# Altium schematic sheet 1_micro.SchDoc: Teseu - MCU
size A4; Author: Gustavo Mariz; CompanyName: Trincabotz; DrawnBy: Gustavo Mariz; Engineer: Gustavo Mariz; Organization: Trincabotz; DocumentNumber: 1; Revision: 0.1; SheetNumber: 2; SheetTotal: 6
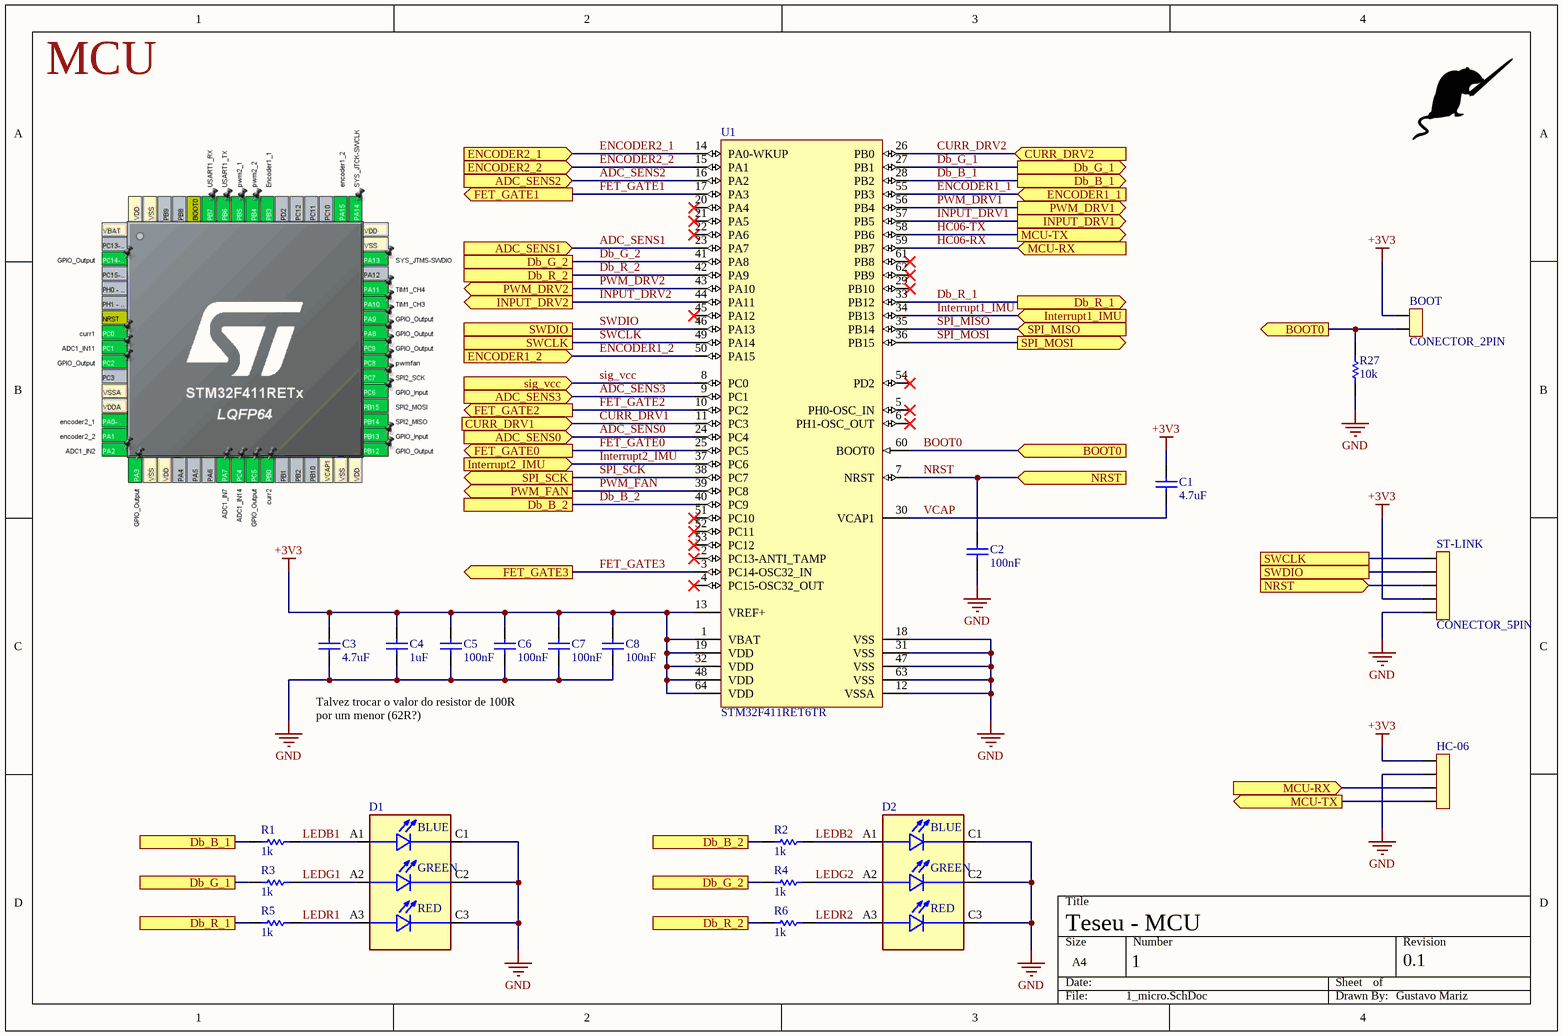
[diagram p0: 1_micro.SchDoc]

## Parts
BOOT  CONECTOR_2PIN  [CON2]
C1  Valor: 4.7uF  [0603]  (hidden comment: CAP)
C2  Valor: 100nF  [0603]  (hidden comment: CAP)
C3  Valor: 4.7uF  [0603]  (hidden comment: CAP)
C4  Valor: 1uF  [0603]  (hidden comment: CAP)
C5  Valor: 100nF  [0603]  (hidden comment: CAP)
C6  Valor: 100nF  [0603]  (hidden comment: CAP)
C7  Valor: 100nF  [0603]  (hidden comment: CAP)
C8  Valor: 100nF  [0603]  (hidden comment: CAP)
D1  KRTBLSLPS1.32-VUVX-EQ+BTBV-D8+TWTZ-L1-B  [LED_KRTBLSLPS1.32-VUVX-EQ+BTBV-D8+TWTZ-L1-B]  (value not drawn)
D2  KRTBLSLPS1.32-VUVX-EQ+BTBV-D8+TWTZ-L1-B  [LED_KRTBLSLPS1.32-VUVX-EQ+BTBV-D8+TWTZ-L1-B]  (value not drawn)
HC-06  (no value)  [CON4]
R1  value 1k  [RES 0603]  (hidden comment: RESISTOR)
R2  value 1k  [RES 0603]  (hidden comment: RESISTOR)
R3  value 1k  [RES 0603]  (hidden comment: RESISTOR)
R4  value 1k  [RES 0603]  (hidden comment: RESISTOR)
R5  value 1k  [RES 0603]  (hidden comment: RESISTOR)
R6  value 1k  [RES 0603]  (hidden comment: RESISTOR)
R27  value 10k  [RES 0805]  (hidden comment: RESISTOR)
ST-LINK  CONECTOR_5PIN  [CON5]
U1  STM32F411RET6TR  [STM-LQFP64_L]

## Ports
ADC_SENS0 (in, see 4_sensores[2B]), ADC_SENS1 (in, see 4_sensores[4B]), ADC_SENS2 (in, see 4_sensores[2C]), ADC_SENS3 (in, see 4_sensores[4C]), BOOT0 (in, see 1_micro[4B]), BOOT0 (out, see 1_micro[3B]), CURR_DRV1 (in, see 2_drivers_e_Motores[3B]), CURR_DRV2 (in, see 2_drivers_e_Motores[3C]), Db_B_1 (out, see 1_micro[1D]), Db_B_1 (see 1_micro[3A]), Db_B_2 (see 1_micro[2B]), Db_B_2 (see 1_micro[2D]), Db_G_1 (out, see 1_micro[1D]), Db_G_1 (see 1_micro[3A]), Db_G_2 (see 1_micro[2B]), Db_G_2 (see 1_micro[2D]), Db_R_1 (out, see 1_micro[1D]), Db_R_1 (see 1_micro[3B]), Db_R_2 (see 1_micro[2B]), Db_R_2 (see 1_micro[2D]), ENCODER1_1 (in, see 2_drivers_e_Motores[4B]), ENCODER1_2 (in, see 2_drivers_e_Motores[4B]), ENCODER2_1 (in, see 2_drivers_e_Motores[4C]), ENCODER2_2 (in, see 2_drivers_e_Motores[4C]), FET_GATE0 (out, see 4_sensores[1B]), FET_GATE1 (out, see 4_sensores[2B]), FET_GATE2 (out, see 4_sensores[1D]), FET_GATE3 (out, see 4_sensores[2D]), INPUT_DRV1 (out, see 2_drivers_e_Motores[2A]), INPUT_DRV2 (out, see 2_drivers_e_Motores[2C]), Interrupt1_IMU (in, see 3_imu[2B]), Interrupt2_IMU (in, see 3_imu[2B]), MCU-RX (in, see 1_micro[3A]), MCU-RX (in, see 1_micro[4D]), MCU-TX (out, see 1_micro[3A]), MCU-TX (out, see 1_micro[4D]), NRST (in, see 1_micro[3B]), NRST (in, see 1_micro[4C]), PWM_DRV1 (out, see 2_drivers_e_Motores[2A]), PWM_DRV2 (out, see 2_drivers_e_Motores[2C]), PWM_FAN (out), sig_vcc (in, see 5_power[2C]), SPI_MISO (in, see 3_imu[3B]), SPI_MOSI (out, see 3_imu[3B]), SPI_SCK (out, see 3_imu[2C]), SWCLK (see 1_micro[2B]), SWCLK (see 1_micro[4C]), SWDIO (see 1_micro[2B]), SWDIO (see 1_micro[4C])

## Nets
+3V3: BOOT.2 C1.2 C3.2 C4.2 C5.2 C6.2 C7.2 C8.2 HC-06.4 ST-LINK.2 U1.1(VBAT) U1.13(VREF+) U1.19(VDD) U1.32(VDD) U1.48(VDD) U1.64(VDD)
GND: C2.1 C3.1 C4.1 C5.1 C6.1 C7.1 C8.1 D1.C1(CATHODE_BLUE) D1.C2(CATHODE_TRUE_GREEN) D1.C3(CATHODE_RED) D2.C1(CATHODE_BLUE) D2.C2(CATHODE_TRUE_GREEN) D2.C3(CATHODE_RED) HC-06.3 R27.1 ST-LINK.1 U1.12(VSSA) U1.18(VSS) U1.31(VSS) U1.47(VSS) U1.63(VSS)
ADC_SENS0: U1.24(PC4) ; port ADC_SENS0
ADC_SENS1: U1.23(PA7) ; port ADC_SENS1
ADC_SENS2: U1.16(PA2) ; port ADC_SENS2
ADC_SENS3: U1.9(PC1) ; port ADC_SENS3
BOOT0: BOOT.1 R27.2 U1.60(BOOT0) ; port BOOT0
CURR_DRV1: U1.11(PC3) ; port CURR_DRV1
CURR_DRV2: U1.26(PB0) ; port CURR_DRV2
Db_B_1: R1.1 U1.28(PB2) ; port Db_B_1
Db_B_2: R2.1 U1.40(PC9) ; port Db_B_2
Db_G_1: R3.1 U1.27(PB1) ; port Db_G_1
Db_G_2: R4.1 U1.41(PA8) ; port Db_G_2
Db_R_1: R5.1 U1.33(PB12) ; port Db_R_1
Db_R_2: R6.1 U1.42(PA9) ; port Db_R_2
ENCODER1_1: U1.55(PB3) ; port ENCODER1_1
ENCODER1_2: U1.50(PA15) ; port ENCODER1_2
ENCODER2_1: U1.14(PA0-WKUP) ; port ENCODER2_1
ENCODER2_2: U1.15(PA1) ; port ENCODER2_2
FET_GATE0: U1.25(PC5) ; port FET_GATE0
FET_GATE1: U1.17(PA3) ; port FET_GATE1
FET_GATE2: U1.10(PC2) ; port FET_GATE2
FET_GATE3: U1.3(PC14-OSC32_IN) ; port FET_GATE3
HC06-RX: HC-06.2 U1.59(PB7) ; port MCU-RX
HC06-TX: HC-06.1 U1.58(PB6) ; port MCU-TX
INPUT_DRV1: U1.57(PB5) ; port INPUT_DRV1
INPUT_DRV2: U1.44(PA11) ; port INPUT_DRV2
Interrupt1_IMU: U1.34(PB13) ; port Interrupt1_IMU
Interrupt2_IMU: U1.37(PC6) ; port Interrupt2_IMU
LEDB1: D1.A1(ANODE_BLUE) R1.2
LEDB2: D2.A1(ANODE_BLUE) R2.2
LEDG1: D1.A2(ANODE_TRUE_GREEN) R3.2
LEDG2: D2.A2(ANODE_TRUE_GREEN) R4.2
LEDR1: D1.A3(ANODE_RED) R5.2
LEDR2: D2.A3(ANODE_RED) R6.2
NRST: C2.2 ST-LINK.3 U1.7(NRST) ; port NRST
PWM_DRV1: U1.56(PB4) ; port PWM_DRV1
PWM_DRV2: U1.43(PA10) ; port PWM_DRV2
PWM_FAN: U1.39(PC8) ; port PWM_FAN
sig_vcc: U1.8(PC0) ; port sig_vcc
SPI_MISO: U1.35(PB14) ; port SPI_MISO
SPI_MOSI: U1.36(PB15) ; port SPI_MOSI
SPI_SCK: U1.38(PC7) ; port SPI_SCK
SWCLK: ST-LINK.5 U1.49(PA14) ; port SWCLK
SWDIO: ST-LINK.4 U1.46(PA13) ; port SWDIO
VCAP: C1.1 U1.30(VCAP1)

Not connected (* = marked no-connect by the designer): U1 2(PC13-ANTI_TAMP)* 4(PC15-OSC32_OUT)* 5(PH0-OSC_IN)* 6(PH1-OSC_OUT)* 20(PA4)* 21(PA5)* 22(PA6)* 29(PB10)* 45(PA12)* 51(PC10)* 52(PC11)* 53(PC12)* 54(PD2)* 61(PB8)* 62(PB9)*

## Notes on the sheet
- MCU
- Talvez trocar o valor do resistor de 100R por um menor (62R?)
- Gustavo Mariz
- (in symbol KRTBLSLPS1.32-VUVX-EQ+BTBV-D8+TWTZ-L1-B) BLUE; GREEN; RED

## Library data of the parts
C1-C8 = CAP. CERÂMICO: Capacitor; Criador por: Luigi Eduardo; Pertence a: Trincabotz; Criado em: 26/06/2012
D1 D2 = KRTBLSLPS1.32-VUVX-EQ+BTBV-D8+TWTZ-L1-B: Red, Green, Blue (RGB) 621nm Red, 532nm Green, 467nm Blue LED Indication - Discrete 2.05V Red, 2.65V Green, 2.85V Blue 6-SMD, J-Lead; MF: OSRAM Opto Semiconductors Inc.; Check_prices: https://www.snapeda.com/parts/KRTBLSLPS1.32-VUVX-EQ+BTBV-D8+TWTZ-L1-B/OSRAM+Opto+Semiconductors+Inc./view-part/?ref=eda; SnapEDA_Link: https://www.snapeda.com/parts/KRTBLSLPS1.32-VUVX-EQ+BTBV-D8+TWTZ-L1-B/OSRAM+Opto+Semiconductors+Inc./view-part/?ref=snap; Value: *; Purchase-URL: https://pricing.snapeda.com/search/part/KRTBLSLPS1.32-VUVX-EQ+BTBV-D8+TWTZ-L1-B/?ref=eda; Availability: In Stock; Price: None; MP: KRTBLSLPS1.32-VUVX-EQ+BTBV-D8+TWTZ-L1-B; Package: SMD-6 OSRAM Opto Semiconductors Inc.
HC-06 = CONECTOR_4PIN
U1 = CMP-0243-00169-2: ARM Cortex-M4 32-bit MCU+FPU, 512 KB Flash, 128 KB RAM, 50 I/Os, 64-Pin LQFP, -40 to 85 degC, Tape and Reel; Operating Frequency(F) (Processor speed) (MHz): 100; FLASH Size (Prog) (kB): 512; Supply Voltage(Vcc) min (V): 1.7; Internal RAM Size (kB): 128; I/Os (High Current): 50; Packing: Tape and Reel; ComponentLink1Description: Manufacturer URL; Package Description: LQFP64; DatasheetVersion: Rev. 6; Mounting Technology: Surface Mount; Package Reference: 64-Pin Low-profile Quad Flat Package, Body 10 x 10 mm, Pitch 0.5 mm; ComponentLink2Description: Datasheet; Core: ARM Cortex-M4; ComponentLink2URL: http://www.st.com/st-web-ui/static/active/en/resource/technical/document/datasheet/DM00115249.pdf; ComponentLink1URL: http://www.st.com/